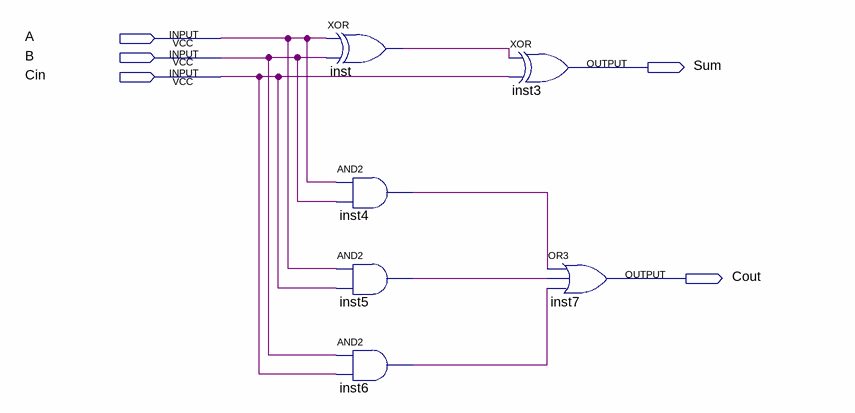
[diagram p0: schematic sheet]
// Quartus schematic fulladder.bdf as structural Verilog: 6 symbols, 5 pins
module fulladder (
  input  A,
  input  B,
  input  Cin,
  output Sum,
  output Cout
);

  wire inst4_out, inst5_out, inst6_out, inst_out;

  xor inst (inst_out, A, B);
  and inst4 (inst4_out, A, B);
  and inst5 (inst5_out, A, Cin);
  and inst6 (inst6_out, B, Cin);
  xor inst3 (Sum, inst_out, Cin);
  or inst7 (Cout, inst4_out, inst5_out, inst6_out);
endmodule
